# EAGLE schematic ATEMconsole-slider (EAGLE 6.2)
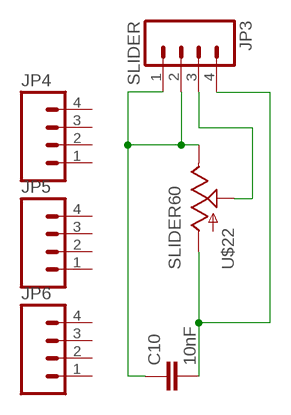
[diagram p0: schematic, sheet 1]

## Parts
C10  10nF  CAP_  [AXIAL-5MM]
JP3  SLIDER  M04PTH  [1X04]
JP4  M04PTH  [1X04]
JP5  M04PTH  [1X04]
JP6  M04PTH  [1X04]
U$22  SLIDER60  [SLIDER60]

## Nets
N$2 [Power]: C10.P$1 JP3.1 JP3.2 U$22.1(E)
N$3 [Power]: C10.P$2 JP3.4 U$22.3(A)
N$132: JP3.3 U$22.2A(S)
Unconnected: JP4.1 JP4.2 JP4.3 JP4.4 JP5.1 JP5.2 JP5.3 JP5.4 JP6.1 JP6.2 JP6.3 JP6.4

## Library data of the parts
C10 = SparkFun:CAP: Capacitor Standard 0603 ceramic capacitor, and 0.1" leaded capacitor.
JP3-JP6 = SparkFun:M04: Header 4 Standard 4-pin 0.1" header. Use with straight break away headers (SKU : PRT-00116), right angle break away headers (PRT-00553), swiss pins (PRT-00743), machine pins (PRT-00117), and female headers (PRT-00115). Molex polarized connector foot print use with SKU : PRT-08231 with associated crimp pins and housings. 1MM SMD Version SKU: PRT-10208
U$22 = SKAARHOJ:SLIDER

## Net classes
0 default: width 0.254 mm, clearance 0.254 mm
1 Power: width 0.254 mm, clearance 0.254 mm